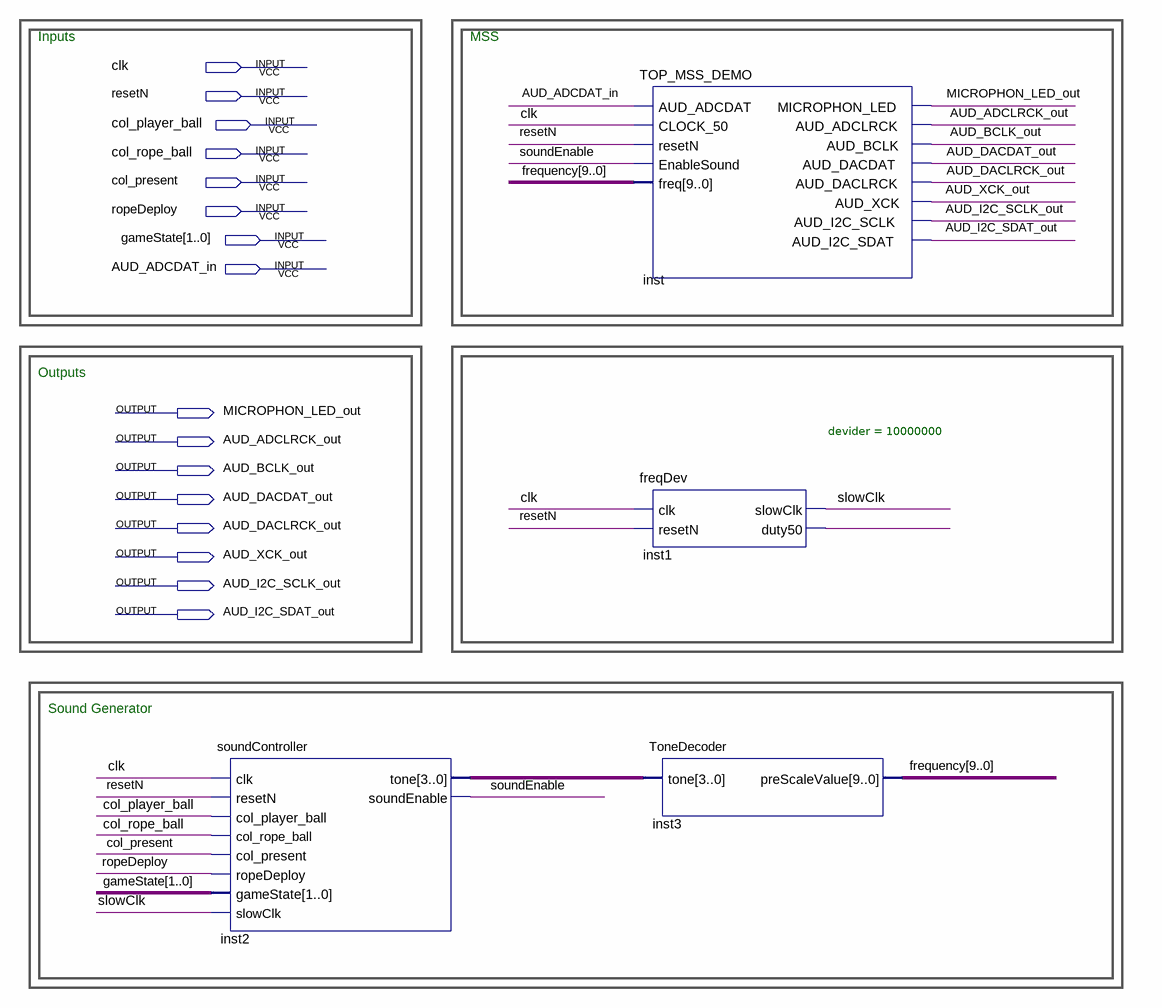
[diagram p0: schematic sheet]
// Quartus schematic soundSystem.bdf as structural Verilog: 4 symbols, 16 pins
module soundSystem (
  input  clk,
  input  resetN,
  input  col_player_ball,
  input  col_rope_ball,
  input  col_present,
  input  ropeDeploy,
  input  [1:0] gameState,
  input  AUD_ADCDAT_in,
  output MICROPHON_LED_out,
  output AUD_ADCLRCK_out,
  output AUD_BCLK_out,
  output AUD_DACDAT_out,
  output AUD_DACLRCK_out,
  output AUD_XCK_out,
  output AUD_I2C_SCLK_out,
  output AUD_I2C_SDAT_out
);

  wire inst1_duty50, slowClk, soundEnable;
  wire [3:0] inst2_tone;
  wire [9:0] frequency;

  soundController inst2 (
    .clk(clk), .resetN(resetN), .col_player_ball(col_player_ball), .col_rope_ball(col_rope_ball),
    .col_present(col_present), .ropeDeploy(ropeDeploy), .gameState(gameState), .slowClk(slowClk),
    .tone(inst2_tone), .soundEnable(soundEnable));
  TOP_MSS_DEMO inst (
    .AUD_ADCDAT(AUD_ADCDAT_in), .CLOCK_50(clk), .resetN(resetN), .EnableSound(soundEnable), .freq(frequency),
    .MICROPHON_LED(MICROPHON_LED_out), .AUD_DACDAT(AUD_DACDAT_out), .AUD_XCK(AUD_XCK_out),
    .AUD_I2C_SCLK(AUD_I2C_SCLK_out), .AUD_ADCLRCK(AUD_ADCLRCK_out), .AUD_BCLK(AUD_BCLK_out),
    .AUD_DACLRCK(AUD_DACLRCK_out), .AUD_I2C_SDAT(AUD_I2C_SDAT_out));
  freqDev #(.devider(10000000)) inst1 (.clk(clk), .resetN(resetN), .slowClk(slowClk), .duty50(inst1_duty50));
  ToneDecoder inst3 (.tone(inst2_tone), .preScaleValue(frequency));

  // Notes on the sheet:
  //   Inputs
  //   MSS
  //   Outputs
  //   Sound Generator
endmodule
